# Altium project Cortes.PrjPcb (part 3 of 3)

## Sheet MezzanineConnectors.SchDoc
size 420 x 297 mm; SheetNumber: 9; SheetTotal: 10; PageSetup: Record=PageOptions|CenterHorizontal=True|CenterVertical=True|PrintScale=0.96|XCorrection=1.00|YCorrection=1.00|PrintKind=1|BorderSize=5000000|LeftOffset=0|BottomOffset=0|Orientation=2|PaperLength=4318|PaperWidth=2794|Scale=100|PaperSource=7|PrintQuality=600|MediaType=1|DitherType=10|PaperKind=11" x 17"|PrintScaleMode=1
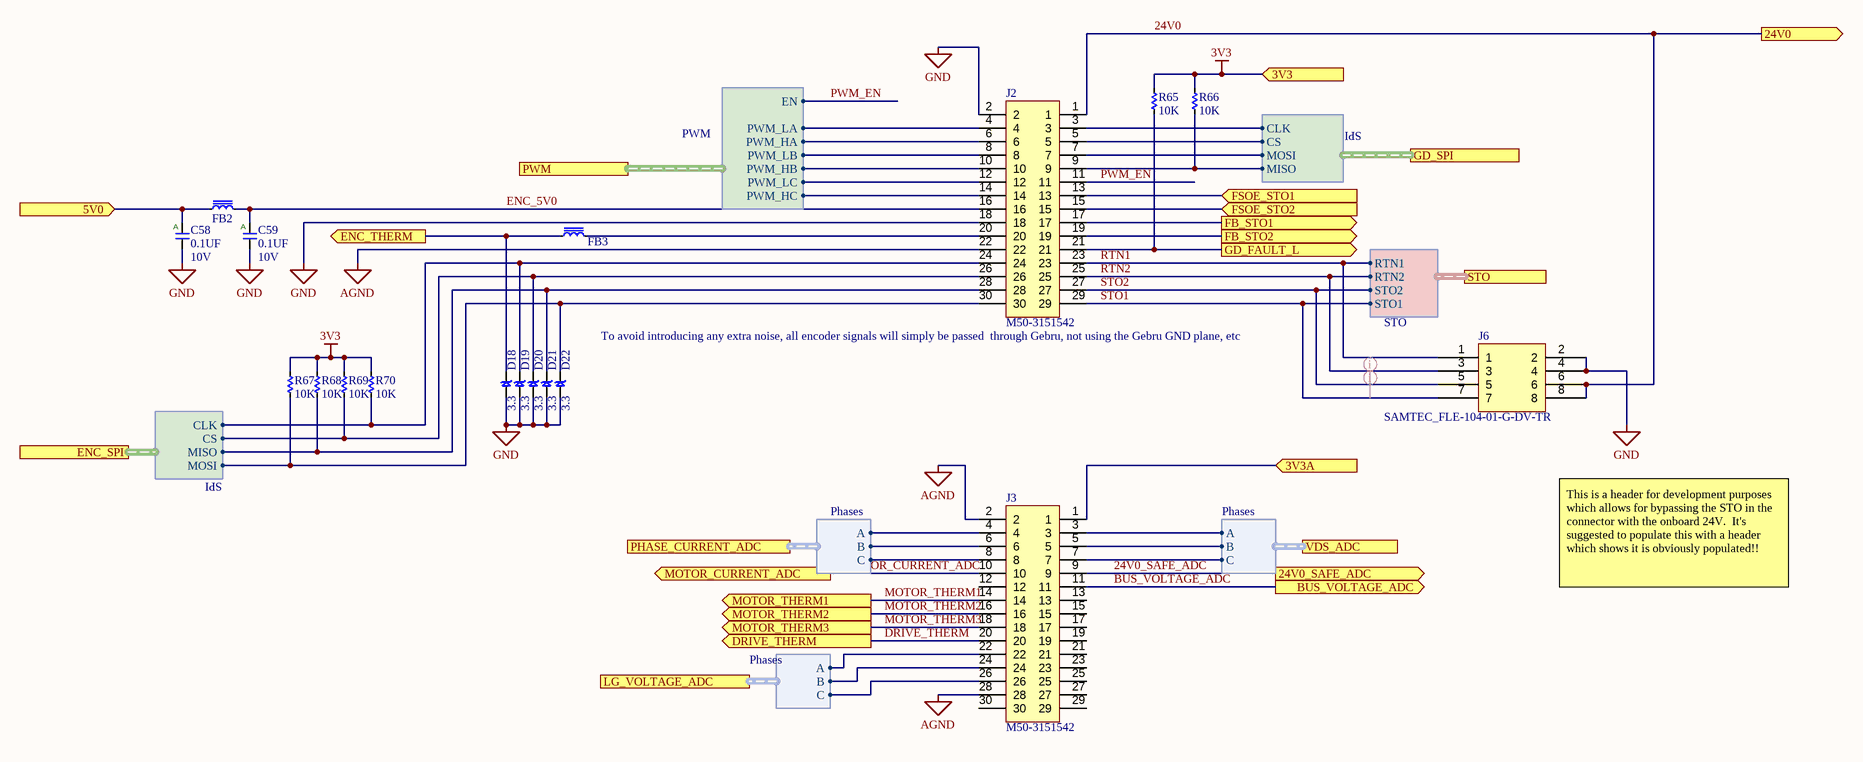
[diagram p8: MezzanineConnectors.SchDoc]

### Parts
C58  value 0.1UF  Voltage: 10V  [C0201Y]  (hidden comment: __Template_Cap_Auto)
C59  value 0.1UF  Voltage: 10V  [C0201Y]  (hidden comment: __Template_Cap_Auto)
D18  3.3  [SOD1060X40]
D19  3.3  [SOD1060X40]
D20  3.3  [SOD1060X40]
D21  3.3  [SOD1060X40]
D22  3.3  [SOD1060X40]
FB2  LAIRD MI0603L221R-10  [INDC160X80X105L30N]  (value not drawn)
FB3  LAIRD MI0603L221R-10  [INDC160X80X105L30N]  (value not drawn)
J2  MFG P/N: M50-3151542  [HARWIN_M50-3151542]
J3  MFG P/N: M50-3151542  [HARWIN_M50-3151542]
J6  SAMTEC_FLE-104-01-G-DV-TR  [SAMTEC_FLE-104-01-G-DV-TR]
R65  value 10K  [R0201_H0.26MM]  (hidden comment: __Template_Resistor)
R66  value 10K  [R0201_H0.26MM]  (hidden comment: __Template_Resistor)
R67  value 10K  [R0201_H0.26MM]  (hidden comment: __Template_Resistor)
R68  value 10K  [R0201_H0.26MM]  (hidden comment: __Template_Resistor)
R69  value 10K  [R0201_H0.26MM]  (hidden comment: __Template_Resistor)
R70  value 10K  [R0201_H0.26MM]  (hidden comment: __Template_Resistor)

### Ports
3V3 (in), 3V3A (in), 5V0 (in), 24V0 (out), 24V0_SAFE_ADC (out), BUS_VOLTAGE_ADC (out), DRIVE_THERM (out), ENC_SPI (harness SPI), ENC_THERM (out), FB_STO1 (out), FB_STO2 (out), FSOE_STO1 (in), FSOE_STO2 (in), GD_FAULT_L (out), GD_SPI (harness SPI), LG_VOLTAGE_ADC (harness Phases), MOTOR_CURRENT_ADC (out), MOTOR_THERM1 (out), MOTOR_THERM2 (out), MOTOR_THERM3 (out), PHASE_CURRENT_ADC (harness Phases), PWM (harness PWM), STO (harness STO), VDS_ADC (harness Phases)

### Harnesses
Phases: A, B, C
PWM: EN, PWM_HA, PWM_LA, PWM_HB, PWM_LB, PWM_HC, PWM_LC
SPI: CLK, CS, MOSI, MISO
STO: RTN1, RTN2, STO1, STO2

### Nets
3V3: R65.2 R66.2 R67.2 R68.2 R69.2 R70.2 ; port 3V3
3V3A: J3.1 ; port 3V3A
5V0: C58.1 FB2.1 ; port 5V0
AGND: J2.22 J3.2 J3.28
GND: C58.2 C59.2 D18.A D19.A D20.A D21.A D22.A J2.2 J2.18 J6.2 J6.4
24V0: J2.1 J6.6 J6.8 ; port 24V0
24V0_SAFE_ADC: J3.9 ; port 24V0_SAFE_ADC
BUS_VOLTAGE_ADC: J3.11 ; port BUS_VOLTAGE_ADC
DRIVE_THERM: J3.20 ; port DRIVE_THERM
ENC_5V0: C59.1 FB2.2 J2.16
ENC_CLK: D19.K J2.24 R70.1 ; port ENC_SPI.CLK
ENC_CS: D20.K J2.26 R69.1 ; port ENC_SPI.CS
ENC_MISO: D21.K J2.28 R68.1 ; port ENC_SPI.MISO
ENC_MOSI: D22.K J2.30 R67.1 ; port ENC_SPI.MOSI
FB_STO1: J2.17 ; port FB_STO1
FB_STO2: J2.19 ; port FB_STO2
FSOE_STO1: J2.13 ; port FSOE_STO1
FSOE_STO2: J2.15 ; port FSOE_STO2
GD_FAULT_L: J2.21 R65.1 ; port GD_FAULT_L
GD_PWM_HA: J2.6 ; port PWM.PWM_HA
GD_PWM_HB: J2.10 ; port PWM.PWM_HB
GD_PWM_HC: J2.14 ; port PWM.PWM_HC
GD_PWM_LA: J2.4 ; port PWM.PWM_LA
GD_PWM_LB: J2.8 ; port PWM.PWM_LB
GD_PWM_LC: J2.12 ; port PWM.PWM_LC
GD_SPI_CLK: J2.3 ; port GD_SPI.CLK
GD_SPI_CS: J2.5 ; port GD_SPI.CS
GD_SPI_MISO: J2.9 R66.1 ; port GD_SPI.MISO
GD_SPI_MOSI: J2.7 ; port GD_SPI.MOSI
IA_ADC: J3.4 ; port PHASE_CURRENT_ADC.A
IB_ADC: J3.6 ; port PHASE_CURRENT_ADC.B
IC_ADC: J3.8 ; port PHASE_CURRENT_ADC.C
MOTOR_CURRENT_ADC: J3.10 ; port MOTOR_CURRENT_ADC
MOTOR_THERM1: J3.14 ; port MOTOR_THERM1
MOTOR_THERM2: J3.16 ; port MOTOR_THERM2
MOTOR_THERM3: J3.18 ; port MOTOR_THERM3
PWM_EN: J2.11 ; port PWM.EN  [project net GD_PWM_EN]
RTN1: J2.23 J6.1 ; port STO.RTN1
RTN2: J2.25 J6.3 ; port STO.RTN2
STO1: J2.29 J6.7 ; port STO.STO1
STO2: J2.27 J6.5 ; port STO.STO2
VA_ADC: J3.22 ; port LG_VOLTAGE_ADC.A
VB_ADC: J3.24 ; port LG_VOLTAGE_ADC.B
VC_ADC: J3.26 ; port LG_VOLTAGE_ADC.C
VDSA_ADC: J3.3 ; port VDS_ADC.A
VDSB_ADC: J3.5 ; port VDS_ADC.B
VDSC_ADC: J3.7 ; port VDS_ADC.C
NetC18_1: D18.K FB3.1 ; port ENC_THERM
NetFB3_2: FB3.2 J2.20

Not connected (* = marked no-connect by the designer): J3 12 13 15 17 19 21 23 25 27 29 30

### Layout directives
net class 24V: STO1, STO2

### Notes on the sheet
- (near J2) To avoid introducing any extra noise, all encoder signals will simply be passed
  through Gebru, not using the Gebru GND plane, etc
- This is a header for development purposes which allows for bypassing the STO in the connector with the onboard 24V.  It's suggested to populate this with a header which shows it is obviously populated!!
- CREATIVE COMMONS
- PUBLIC LICENSE:
- BARKOUR ROBOT
- CC BY-NC 4.0
- APPROVED
- DWG NO
- GOOGLE LLC
- FILE
- RELEASED
- 2024/05/09
- SIZE
- 1600 AMPHITHEATRE PARKWAY
- MOUNTAIN VIEW CA 94043
- A3
- SHEET
- OF
- THIS DESIGN IS BEING PROVIDED  FOR NON-COMMERCIAL USE ONLY. THE USE OF =SCIENTIST_NAME_POSSESSIVE NAME IN CONNECTION WITH THE DESIGN IS NOT INTENDED TO IMPLY THAT =SCIENTIST_NAME SPONSORS OR ENDORSES THE DESIGN, GOOGLE LLC, OR ANY OF GOOGLE LLC'S PRODUCTS OR SERVICES.
- (in symbol 934) A

### Library data of the parts
C58 C59 = 934: as C13-C24 on sheet Temperature; Status: Released; Package: 0201; Dielectric: X6S; Tolerance: 10%; Height: 0.33mm T; Supplier 1: Digi-key; HelpURL: https://www.digikey.com/product-detail/en/murata-electronics/GRT033C81A104KE01D/490-12232-1-ND/5416933; ComponentLink1Description: Datasheet; ComponentLink1URL: https://search.murata.co.jp/Ceramy/image/img/A01X/G101/ENG/GRT033C81A104KE01-01.pdf; COMMON: 150-01178-00; LOON: 150-01178-00; Supplier Part Number 1: 490-12232-1-ND
D18-D22 = 192: TVS, DIODE, UNIDIR, 3.3VRWM, 4.8VBR, 7.8VCL, SOD-923; ID: 192; MFG: ON Semiconductor; MFG P/N: ESD9R3.3ST5G; Value: ESD9R3.3ST5G; Diode Type: Zener; PROXY: 480-01364-00; LOON: 430-00045-00; Voltage - Clamping (Max) @ Ipp: 7.8V; Status: Released; Package: SOD-923; Category: Diode; RoHS Compliant: Yes; Mounting Type: SMD; Operating Temperature – Junction: -55°C ~ 125°C (TJ); Supplier 1: Digi-Key; HelpURL: https://www.digikey.in/product-detail/en/on-semiconductor/ESD9R3.3ST5G/ESD9R3.3ST5GOSCT-ND/2704997; ComponentLink1Description: Datasheet; ComponentLink1URL: http://www.onsemi.com/pub/Collateral/ESD9R3.3S-D.PDF; Height: 0.4mm; Supplier Part Number 1: ESD9R3.3ST5GOSCT-ND
FB2 FB3 = LAIRD_MI0603L221R-10: LAIRD - MI0603L221R-10 - Ferrite Bead, 0603 [1608 Metric], 220 ohm, 2 A, MI Series, 0.05 ohm; Manufacturer: Laird Technologies; Grade: Commercial; Value: 220 Ohms @ 100 MHz; Current Rating: 2A; Number of Lines: 1; DC Resistance (DCR): 50mR; Impedance: 220R; Test Frequency: 100MHz; Shielding: Unshielded; Manufacturer Part Number: MI0603L221R-10; Package: Inductor, 0603; ComponentLink1Description: Datasheet; ComponentLink1URL: https://media.digikey.com/pdf/Data%20Sheets/Laird%20Technologies/EMI_Filtering_and_RF_Inductors.pdf; Category: Ferrite Beads; Status: Preliminary; Storage Temperature: -40 °C ~ 125 °C; Operating Temperature: -40 °C ~ 125 °C; Supplier 1: Mouser; Supplier Part Number 1: 875-MI0603L221R-10; RoHS: Yes; Stock 1: 2603; Pricing 1: 1=0.10000, 10=0.07000, 50=0.06400, 100=0.06400, 250=0.06000, 500=0.05600, 1000=0.05000, 4000=0.04800, 10000=0.04800 (USD); Mount: Surface Mount; Case/Package: 0603; Case Code (Metric): 1608; Case Code (Imperial): 0603; Weight: 0.000192oz; Core Material: Ferrite; Material: Ferrite; Min Operating Temperature: -40°C; Max Operating Temperature: 125°C; Packaging: Tape and Reel; Package Quantity: 1; Max Current Rating: 2A; Series: MI; Max DC Current: 2A; Termination: SMD/SMT; Length: 1.6mm; Width: 0.031inch; Height: 0.8mm; Depth: 0.8mm; REACH SVHC: Unknown; Lead Free: Lead Free; ComponentLink2URL: https://datasheet.ciiva.com/1013/mi0603l221r-10-1013287.pdf?src-supplier=Digi-Key; ComponentLink2Description: https://datasheet.ciiva.com/1013/mi0603l221r-10-1013287.pdf?src-supplier=Digi-Key; ComponentLink3URL: https://datasheet.ciiva.com/3082/mi0603l221r-10-c-vp-3082211.pdf?src-supplier=Avnet; ComponentLink3Description: https://datasheet.ciiva.com/3082/mi0603l221r-10-c-vp-3082211.pdf?src-supplier=Avnet; ComponentLink4URL: https://datasheet.ciiva.com/22650/1685986-22650407.pdf?src-supplier=Element14; ComponentLink4Description: https://datasheet.ciiva.com/22650/1685986-22650407.pdf?src-supplier=Element14
J2 J3 = 1205: CONN, RCPT, FEMALE, 30 P, 1.27MM, 2.45MM H, GOLD, SMD; ID: 1205; MFG: Harwin Inc.; Connector Type: Receptacle, Bottom or Top Entry; Number of Positions: 30; Current Rating: 1A; EES: 210-04983-00; Sub Assy Qty 2: 0; Status: Released; RoHS Compliant: Yes; Mounting Type: Surface Mount; Orientation: Vertical; Pitch: 1.27mm; Number of Rows: 2; Row Spacing: 1.27mm; Gender: Female; Features: Board Guide; Operating Temperature: -40°C ~ 105°C; Supplier 1: Digi-Key; HelpURL: https://www.digikey.com/en/products/detail/harwin-inc/M50-3151542/2762128; ComponentLink1Description: Datasheet; ComponentLink1URL: https://cdn.harwin.com/pdfs/M50-315.pdf; Height: 2.5mm; Supplier Part Number 1: 952-1707-ND; Sub Assy Qty 3: 0; Sub Assy Qty 4: 0
J6 = SAMTEC_FLE-104-01-G-DV-TR: CONN RCPT .05" 8POS DUAL SMD; Manufacturer: Samtec; Contact Resistance: 15mR; Number of Contacts: 8; Gender: Receptacle; Max Current Rating: 1.75A; Pitch: 1.27mm; Row Spacing: 0.05inch; Supplier 1: Digi-Key; Supplier Part Number 1: SAM1226-04-ND; Manufacturer Part Number: FLE-104-01-G-DV; RoHS: Yes; Category: Headers and Wire Housings; Stock 1: 413; Pricing 1: 1=1.50000, 10=1.35800, 25=1.27480, 50=1.21940, 100=1.16390, 250=1.05304, 500=0.96992 (USD); Mount: Surface Mount; Contact Plating: Gold; Contact Material: Bronze; Housing Color: Black; Housing Material: Polymer; Color: Black; Min Operating Temperature: -55°C; Max Operating Temperature: 125°C; Number of Rows: 2; Packaging: Bulk; Termination: Solder; Orientation: Straight; Connector Type: Receptacle; Number of Positions: 8; Series: FLE; Contact Type: Female Socket; Length: 5.19mm; Width: 3.33mm; Depth: 3.33mm; Radiation Hardening: No; REACH SVHC: No SVHC; Lead Free: Lead Free; ComponentLink1URL: https://datasheet.ciiva.com/747/fle-1xx-xx-xx-dv-x-mkt1-747009.pdf?src-supplier=Digi-Key; ComponentLink1Description: https://datasheet.ciiva.com/747/fle-1xx-xx-xx-dv-x-mkt1-747009.pdf?src-supplier=Digi-Key
R65-R70 = 6783: as R35-R44 on sheet Temperature; Status: Released; Package: 0201; Power: 1/20W; Tolerance: 1%; Height: 0.26mm; Supplier 1: Digi-Key; HelpURL: https://www.digikey.in/product-detail/en/panasonic-electronic-components/ERJ-1GNF1002C/P122414CT-ND/7389440; ComponentLink1Description: Datasheet; ComponentLink1URL: https://industrial.panasonic.com/cdbs/www-data/pdf/RDA0000/AOA0000C304.pdf; LOON: 470-00033-00; Gecko: 470-00033-00; XPN: 470-00033-00; Supplier Part Number 1: P122414CT-ND

## Sheet EtherCATConnectors.SchDoc
size 420 x 297 mm; SheetNumber: 10; SheetTotal: 10; PageSetup: Record=PageOptions|CenterHorizontal=True|CenterVertical=True|PrintScale=0.96|XCorrection=1.00|YCorrection=1.00|PrintKind=1|BorderSize=5000000|LeftOffset=0|BottomOffset=0|Orientation=2|PaperLength=4318|PaperWidth=2794|Scale=100|PaperSource=7|PrintQuality=600|MediaType=1|DitherType=10|PaperKind=11" x 17"|PrintScaleMode=1
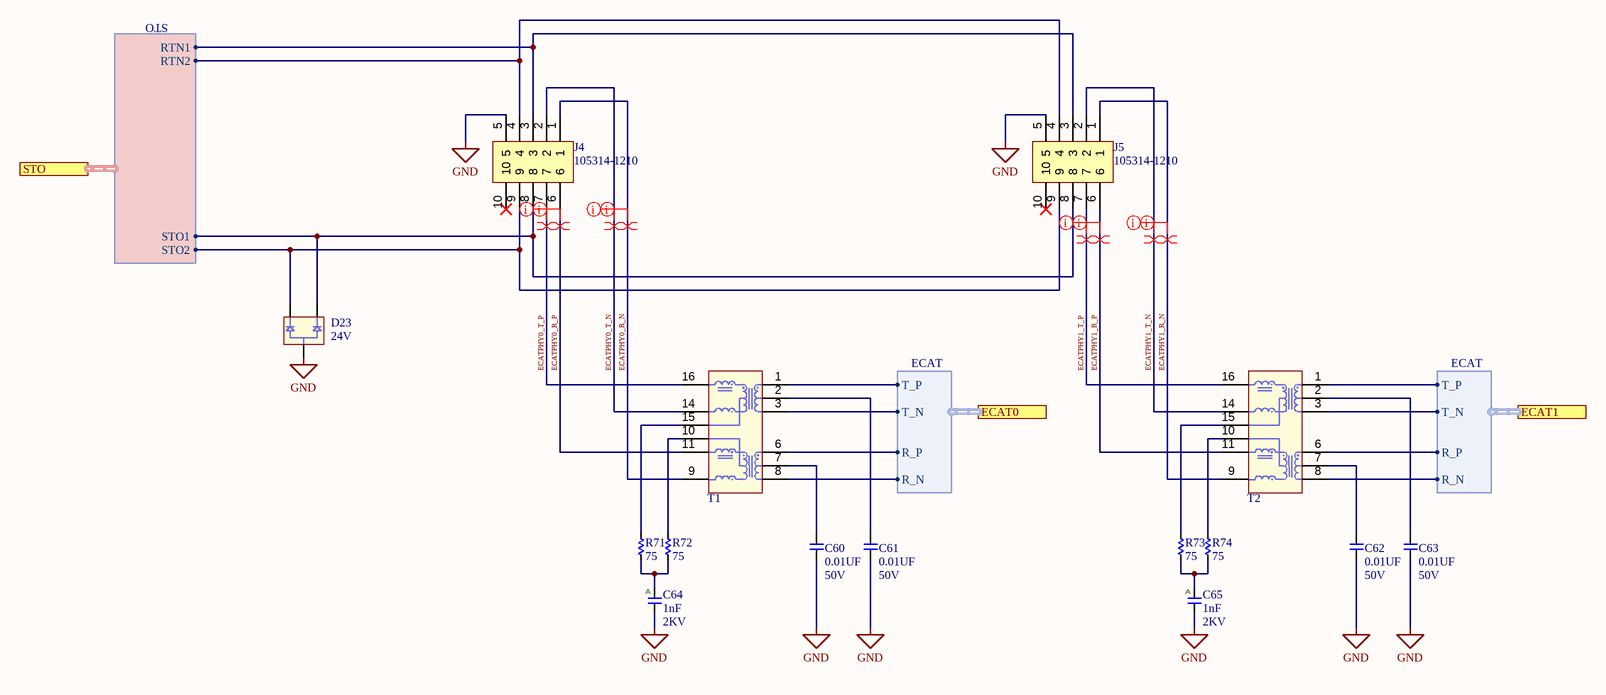
[diagram p9: EtherCATConnectors.SchDoc]

### Parts
C60  value 0.01UF  Voltage: 50V  [C0402]  (hidden comment: __Template_Cap)
C61  value 0.01UF  Voltage: 50V  [C0402]  (hidden comment: __Template_Cap)
C62  value 0.01UF  Voltage: 50V  [C0402]  (hidden comment: __Template_Cap)
C63  value 0.01UF  Voltage: 50V  [C0402]  (hidden comment: __Template_Cap)
C64  value 1nF  Voltage: 2KV  [C1210]  (hidden comment: __Template_Cap_Auto)
C65  value 1nF  Voltage: 2KV  [C1210]  (hidden comment: __Template_Cap_Auto)
D23  24V  [3SOT23]
J4  Manufacturer Part Number: 105314-1210  [MOLEX_1053141210]  (hidden comment: MOLEX_2X5_NANOFIT_1053141210)
J5  Manufacturer Part Number: 105314-1210  [MOLEX_1053141210]  (hidden comment: MOLEX_2X5_NANOFIT_1053141210)
R71  value 75  [R0402]
R72  value 75  [R0402]
R73  value 75  [R0402]
R74  value 75  [R0402]
T1  PULSE_H1102NL  [PULSE_HXXXX]  (value not drawn)
T2  PULSE_H1102NL  [PULSE_HXXXX]  (value not drawn)

### Ports
ECAT0 (harness ECAT), ECAT1 (harness ECAT), STO (harness STO)

### Harnesses
ECAT: R_P, R_N, T_P, T_N
STO: STO1, RTN2, STO2, RTN1

### Nets
GND: C60.2 C61.2 C62.2 C63.2 C64.2 C65.2 D23.3 J4.5 J5.5
ECAT_R0_N: T1.8 ; port ECAT0.R_N
ECAT_R0_P: T1.6 ; port ECAT0.R_P
ECAT_R1_N: T2.8 ; port ECAT1.R_N
ECAT_R1_P: T2.6 ; port ECAT1.R_P
ECAT_T0_N: T1.3 ; port ECAT0.T_N
ECAT_T0_P: T1.1 ; port ECAT0.T_P
ECAT_T1_N: T2.3 ; port ECAT1.T_N
ECAT_T1_P: T2.1 ; port ECAT1.T_P
ECATPHY0_R_N: J4.1 T1.9
ECATPHY0_R_P: J4.6 T1.11
ECATPHY0_T_N: J4.2 T1.14
ECATPHY0_T_P: J4.7 T1.16
ECATPHY1_R_N: J5.1 T2.9
ECATPHY1_R_P: J5.6 T2.11
ECATPHY1_T_N: J5.2 T2.14
ECATPHY1_T_P: J5.7 T2.16
RTN1: J4.3 J5.3 ; port STO.RTN1
RTN2: J4.4 J5.4 ; port STO.RTN2
STO1: D23.1 J4.8 J5.8 ; port STO.STO1
STO2: D23.2 J4.9 J5.9 ; port STO.STO2
NetC60_1: C60.1 T1.7
NetC61_1: C61.1 T1.2
NetC62_1: C62.1 T2.7
NetC63_1: C63.1 T2.2
NetC64_1: C64.1 R71.1 R72.1
NetC65_1: C65.1 R73.1 R74.1
NetR71_2: R71.2 T1.15
NetR72_2: R72.2 T1.10
NetR73_2: R73.2 T2.15
NetR74_2: R74.2 T2.10

Not connected (* = marked no-connect by the designer): J4 10*; J5 10*

### Layout directives
differential pair; differential pair class 100Ohm: ECATPHY0_R_N, ECATPHY0_R_P, ECATPHY0_T_N, ECATPHY0_T_P, ECATPHY1_R_N, ECATPHY1_R_P, ECATPHY1_T_N, ECATPHY1_T_P
net class Diff100Ohm: ECATPHY0_R_N, ECATPHY0_R_P, ECATPHY0_T_N, ECATPHY0_T_P, ECATPHY1_R_N, ECATPHY1_R_P, ECATPHY1_T_N, ECATPHY1_T_P

### Notes on the sheet
- CREATIVE COMMONS
- PUBLIC LICENSE:
- BARKOUR ROBOT
- CC BY-NC 4.0
- APPROVED
- DWG NO
- GOOGLE LLC
- FILE
- RELEASED
- 2024/05/09
- SIZE
- 1600 AMPHITHEATRE PARKWAY
- MOUNTAIN VIEW CA 94043
- A3
- SHEET
- OF
- THIS DESIGN IS BEING PROVIDED  FOR NON-COMMERCIAL USE ONLY. THE USE OF =SCIENTIST_NAME_POSSESSIVE NAME IN CONNECTION WITH THE DESIGN IS NOT INTENDED TO IMPLY THAT =SCIENTIST_NAME SPONSORS OR ENDORSES THE DESIGN, GOOGLE LLC, OR ANY OF GOOGLE LLC'S PRODUCTS OR SERVICES.
- (in symbol 6) A

### Library data of the parts
C60-C63 = 625: CAP, CER, X7R, 0.01uF, 50V, 20%, 0402, 0.56mm T; ID: 625; MFG: KEMET; MFG P/N: C0402C103M5RACTU; XPN: 150-00227-00; EES: 150-04592-00; Status: Released; Package: 0402; Dielectric: X7R; Tolerance: 20%; Height: 0.56mm T; ComponentLink1Description: Datasheet; COMMON: 150-00227-00; LOON: 150-00227-00; Gecko: 150-00227-00
C64 C65 = 6: CAP, CER, X7S, 1000PF, 2KV, 10%, 1210; ID: 6; MFG: TDK; MFG P/N: CGA6M1X7S3D102K200AA; XPN: XS-10001044; COMMON: 150-01098-00; PROXY: 150-04677-00; Status: Released; Package: 1210; Dielectric: X7S; Tolerance: 10%; Height: 2.20mm; Supplier 1: Digi-Key; ComponentLink1Description: Datasheet; Supplier Part Number 1: 445-13038-1-ND
D23 = 176: DIODE, TVS, UNIDIR, DUAL, 24VRWM, 26VBR, 41VCL, SOT-23-3; ID: 176; MFG: Infineon Technologies; MFG P/N: ESD24VS2UE6327HTSA1; Value: ESD24VS2UE6327HTSA1; LOON: 480-01202-00; Gecko: 480-01676-00; Voltage - Clamping (Max) @ Ipp: 41V; Status: Released; Package: TO-236-3, SC-59, SOT-23-3; Category: Diode; RoHS Compliant: Yes; Diode Type: TVS; Mounting Type: SMD; Voltage - DC Reverse (VR) (MAX): 24V; Operating Temperature – Junction: -55°C ~ 150°C (TJ); Supplier 1: Digi-Key; HelpURL: https://www.digikey.in/product-detail/en/infineon-technologies/ESD24VS2UE6327HTSA1/ESD24VS2UE6327HTSA1CT-ND/1785650; ComponentLink1Description: Datasheet; ComponentLink1URL: https://www.infineon.com/dgdl/Infineon-ESD24VS2U-DS-v01_01-en.pdf?fileId=db3a3043340fff53013413a2249d2ff3; Supplier Part Number 1: ESD24VS2UE6327HTSA1CT-ND
J4 J5 = MOLEX_2X5_NANOFIT_1053141210: Conn HDR 10 POS 2.5mm Solder RA Thru-Hole 10 Terminal 1 Port; Manufacturer: Molex; Connector Type: Header,Male Pin; Number of Positions: 10; Supplier 1: Digi-Key; Supplier Part Number 1: WM15162-ND; RoHS: Yes; Category: Headers and Wire Housings; Stock 1: 2469; Pricing 1: 1=2.84000, 10=2.49900, 120=1.98792, 960=1.64713, 4920=1.47673 (USD); Mount: Through Hole; Contact Plating: Gold; Contact Material: Brass; Contact Shape: Square; Insulation Material: Polymer; Insulation Color: Black; Min Operating Temperature: -40°C; Max Operating Temperature: 105°C; Fastening Type: Latch; Packaging: Tray; Number of Rows: 2; Termination: Solder; RoHS Compliant: Yes; ComponentLink1URL: https://www.molex.com/pdm_docs/ps/PS-105300-100-001.pdf?src-supplier=Digi-Key; ComponentLink1Description: https://www.molex.com/pdm_docs/ps/PS-105300-100-001.pdf?src-supplier=Digi-Key
R71-R74 = 2283: RES, 75, 1%, 1/16W, 0402; ID: 2283; MFG: YAGEO; MFG P/N: RC0402FR-0775RL; COMMON: 470-00607-00; PROXY: 470-10028-00; KOI: 470-17279-00; Status: Released; Package: 0402; Power: 1/16W; Tolerance: 1%; Height: 0.40mm; Supplier 1: Digi-Key; XPN: 470-00607-00; Supplier Part Number 1: 311-75.0LRCT-ND
T1 T2 = PULSE_H1102NL: Telecom Transformer 2(1:1) 0.65Ohm Prim. DCR 0.65Ohm Sec. DCR 16 Terminal Gull Wing SMD; Manufacturer: Pulse; Shielding: Unshielded; Isolation Voltage: 1.5kV; Insertion Loss: -1.1dB; Return Loss: -11.5dB; DC Resistance (DCR): 650mR; Supplier 1: Digi-Key; Supplier Part Number 1: 553-1323-5-ND; Manufacturer Part Number: H1102NL; RoHS: Yes; Category: Transformers; Stock 1: 978; Pricing 1: 1=5.63000, 10=4.55900, 25=3.68600, 50=3.45320, 100=3.29800, 250=3.20100, 500=3.10400, 1000=3.00700 (USD); Mount: Surface Mount; Case/Package: Module; Number of Pins: 16; Weight: 0.098767oz; Min Operating Temperature: 0°C; Max Operating Temperature: 70°C; Turns Ratio: 1:1; Lead/Base Style: Gull Wing; Packaging: Rail/Tube; Package Quantity: 40; Termination: SMD/SMT; Series: -; Length: 12.7mm; Width: 9.53m; Height: 6.09mm; Height - Seated (Max): 6.22mm; Depth: 9.53mm; Radiation Hardening: No; RoHS Compliant: Yes; Lead Free: Lead Free; ComponentLink1URL: https://datasheet.ciiva.com/2938/10-100base-tsingleportsmdmagnetics-rev2008-2938779.pdf?src-supplier=Digi-Key; ComponentLink1Description: https://datasheet.ciiva.com/2938/10-100base-tsingleportsmdmagnetics-rev2008-2938779.pdf?src-supplier=Digi-Key

## Nets that join several sheets
3V3: Processor (7 pins), ProcessorSupport (26 pins), Accelerometer (7 pins), Trinamic (25 pins), Power (9 pins), Microphone (7 pins), MezzanineConnectors (6 pins)
3V3A: ProcessorSupport (FB4.7 FB4.8), Power (6 pins), Temperature (10 pins), MezzanineConnectors (J3.1)
5V0: Power (9 pins), MezzanineConnectors (C58.1 FB2.1)
AGND: 1-Top (TP2.1), ProcessorSupport (6 pins), Power (6 pins), Temperature (15 pins), MezzanineConnectors (J2.22 J3.2 J3.28)
GND: 1-Top (7 pins), Processor (29 pins), ProcessorSupport (64 pins), Accelerometer (14 pins), Trinamic (49 pins), Power (29 pins), Microphone (7 pins), MezzanineConnectors (11 pins), EtherCATConnectors (9 pins)
24V0: Power (7 pins), MezzanineConnectors (J2.1 J6.6 J6.8)
24V0_SAFE_ADC: Processor (U2.P1), MezzanineConnectors (J3.9)
AGM_CLK: Processor (U2.P12), Accelerometer (U1.2)
AGM_CS_AG: Processor (U2.R12), Accelerometer (R2.2 U1.7)
AGM_CS_M: Processor (U2.R9), Accelerometer (R3.2 U1.8)
AGM_DATA_EN_AG: Processor (U2.P14), Accelerometer (U1.13)
AGM_DRDY_M: Processor (U2.R11), Accelerometer (U1.9)
AGM_INT1_AG: Processor (U2.B4), Accelerometer (U1.11)
AGM_INT2_AG: Processor (U2.C4), Accelerometer (U1.12)
AGM_INT_M: Processor (U2.N8), Accelerometer (U1.10)
AGM_MISO: Processor (U2.P13), Accelerometer (U1.5 U1.6)
AGM_MOSI: Processor (U2.M12), Accelerometer (U1.4)
BOOT0: Processor (D17.K J1.19 R9.2 U2.C5), Trinamic (R87.2)
BUS_VOLTAGE_ADC: Processor (U2.R10), MezzanineConnectors (J3.11)
DRIVE_THERM: Temperature (C24.1 R43.1 U3.12), MezzanineConnectors (J3.20)
DRIVE_THERM_ADC: Processor (U2.K3), Temperature (C23.1 R44.2)
ECAT_LATCH_IN0: Processor (U2.J15), Trinamic (U5.C7)
ECAT_LATCH_IN1: Processor (U2.B5), Trinamic (U5.C6)
ECAT_MFC_CS: Processor (U2.B10), Trinamic (U5.D4)
ECAT_MFCIO_0: Processor (U2.D9), Trinamic (U5.J8)
ECAT_MFCNES: Processor (U2.L13), Trinamic (U5.C5)
ECAT_PDI_CLK: Processor (U2.P15), Trinamic (U5.K3)
ECAT_PDI_CS: Processor (U2.R5), Trinamic (U5.L4)
ECAT_PDI_EOF: Processor (U2.P10), Trinamic (U5.G3)
ECAT_PDI_IRQ: Processor (U2.M15), Trinamic (U5.J3)
ECAT_PDI_MISO: Processor (U2.M11), Trinamic (U5.K5)
ECAT_PDI_MOSI: Processor (U2.J4), Trinamic (U5.L5)
ECAT_PDI_SOF: Processor (U2.N12), Trinamic (U5.H3)
ECAT_PROM_INIT: Processor (U2.C13), Trinamic (U5.J5)
ECAT_R0_N: Trinamic (U5.A1), EtherCATConnectors (T1.8)
ECAT_R0_P: Trinamic (U5.B1), EtherCATConnectors (T1.6)
ECAT_R1_N: Trinamic (U5.G1), EtherCATConnectors (T2.8)
ECAT_R1_P: Trinamic (U5.H1), EtherCATConnectors (T2.6)
ECAT_RESET: Processor (U2.E13), Trinamic (C31.1 R46.1 U5.K4)
ECAT_RESET_OUT: Processor (R29.1 U2.B9), Trinamic (U5.J4)
ECAT_SYNC_OUT0: Processor (U2.H14), Trinamic (U5.D7)
ECAT_SYNC_OUT1: Processor (U2.J12), Trinamic (U5.D6)
ECAT_T0_N: Trinamic (U5.D1), EtherCATConnectors (T1.3)
ECAT_T0_P: Trinamic (U5.E1), EtherCATConnectors (T1.1)
ECAT_T1_N: Trinamic (U5.K1), EtherCATConnectors (T2.3)
ECAT_T1_P: Trinamic (U5.L1), EtherCATConnectors (T2.1)
ECAT_WD_STATE: Processor (R32.2 U2.L14), Trinamic (U5.G4)
ECAT_WD_TRIG: Processor (U2.K13), Trinamic (U5.F4)
ENC_CLK: Processor (U2.C12), MezzanineConnectors (D19.K J2.24 R70.1)
ENC_CS: Processor (U2.P5), MezzanineConnectors (D20.K J2.26 R69.1)
ENC_MISO: Processor (U2.C11), MezzanineConnectors (D21.K J2.28 R68.1)
ENC_MOSI: Processor (U2.B11), MezzanineConnectors (D22.K J2.30 R67.1)
ENC_THERM_ADC: Processor (U2.H4), Temperature (C17.1 R38.2)
FB_STO1: Processor (U2.G14), MezzanineConnectors (J2.17)
FB_STO2: Processor (U2.F15), MezzanineConnectors (J2.19)
FSOE_STO1: Processor (U2.G15), MezzanineConnectors (J2.13)
FSOE_STO2: Processor (R32.1 R34.1), MezzanineConnectors (J2.15)
GD_FAULT_L: Processor (U2.F14), MezzanineConnectors (J2.21 R65.1)
GD_PWM_EN: Processor (U2.G13), MezzanineConnectors (J2.11)
GD_PWM_HA: Processor (U2.E14), MezzanineConnectors (J2.6)
GD_PWM_HB: Processor (U2.D14), MezzanineConnectors (J2.10)
GD_PWM_HC: Processor (U2.D13), MezzanineConnectors (J2.14)
GD_PWM_LA: Processor (U2.D15), MezzanineConnectors (J2.4)
GD_PWM_LB: Processor (U2.B14), MezzanineConnectors (J2.8)
GD_PWM_LC: Processor (U2.C14), MezzanineConnectors (J2.12)
GD_SPI_CLK: Processor (U2.B7), MezzanineConnectors (J2.3)
GD_SPI_CS: Processor (U2.G12), MezzanineConnectors (J2.5)
GD_SPI_MISO: Processor (U2.D8), MezzanineConnectors (J2.9 R66.1)
GD_SPI_MOSI: Processor (U2.C7), MezzanineConnectors (J2.7)
IA_ADC: Processor (U2.R3), MezzanineConnectors (J3.4)
IB_ADC: Processor (U2.P3), MezzanineConnectors (J3.6)
IC_ADC: Processor (U2.N7), MezzanineConnectors (J3.8)
MFCIO_SCL: Processor (U2.A2), Trinamic (R84.1 R86.2)
MFCIO_SDA: Processor (U2.B3), Trinamic (R83.1 R85.2)
MIC_CLK: Processor (U2.A7), Microphone (R6.2)
MIC_DATA: Processor (U2.B8), Microphone (R5.2 R7.2)
MOTOR_CURRENT_ADC: Processor (U2.N11), MezzanineConnectors (J3.10)
MOTOR_THERM1: Temperature (C16.1 R35.1 U3.3), MezzanineConnectors (J3.14)
MOTOR_THERM1_ADC: Processor (U2.N2), Temperature (C15.1 R36.2)
MOTOR_THERM2: Temperature (C20.1 R39.1 U3.5), MezzanineConnectors (J3.16)
MOTOR_THERM2_ADC: Processor (U2.J3), Temperature (C19.1 R40.2)
MOTOR_THERM3: Temperature (C22.1 R41.1 U3.10), MezzanineConnectors (J3.18)
MOTOR_THERM3_ADC: Processor (U2.H3), Temperature (C21.1 R42.2)
NetC18_1: Temperature (C18.1 R37.1 U4.3), MezzanineConnectors (D18.K FB3.1)
RTN1: MezzanineConnectors (J2.23 J6.1), EtherCATConnectors (J4.3 J5.3)
RTN2: MezzanineConnectors (J2.25 J6.3), EtherCATConnectors (J4.4 J5.4)
STO1: MezzanineConnectors (J2.29 J6.7), EtherCATConnectors (D23.1 J4.8 J5.8)
STO2: MezzanineConnectors (J2.27 J6.5), EtherCATConnectors (D23.2 J4.9 J5.9)
VA_ADC: Processor (U2.R7), MezzanineConnectors (J3.22)
VB_ADC: Processor (U2.R6), MezzanineConnectors (J3.24)
VC_ADC: Processor (U2.M8), MezzanineConnectors (J3.26)
VDSA_ADC: Processor (U2.P11), MezzanineConnectors (J3.3)
VDSB_ADC: Processor (U2.R8), MezzanineConnectors (J3.5)
VDSC_ADC: Processor (U2.M2), MezzanineConnectors (J3.7)

## Assembly variants
PCBA: not fitted R17 R32 R83